# EAGLE design driver-shield-v2 (EAGLE 7.1.0)
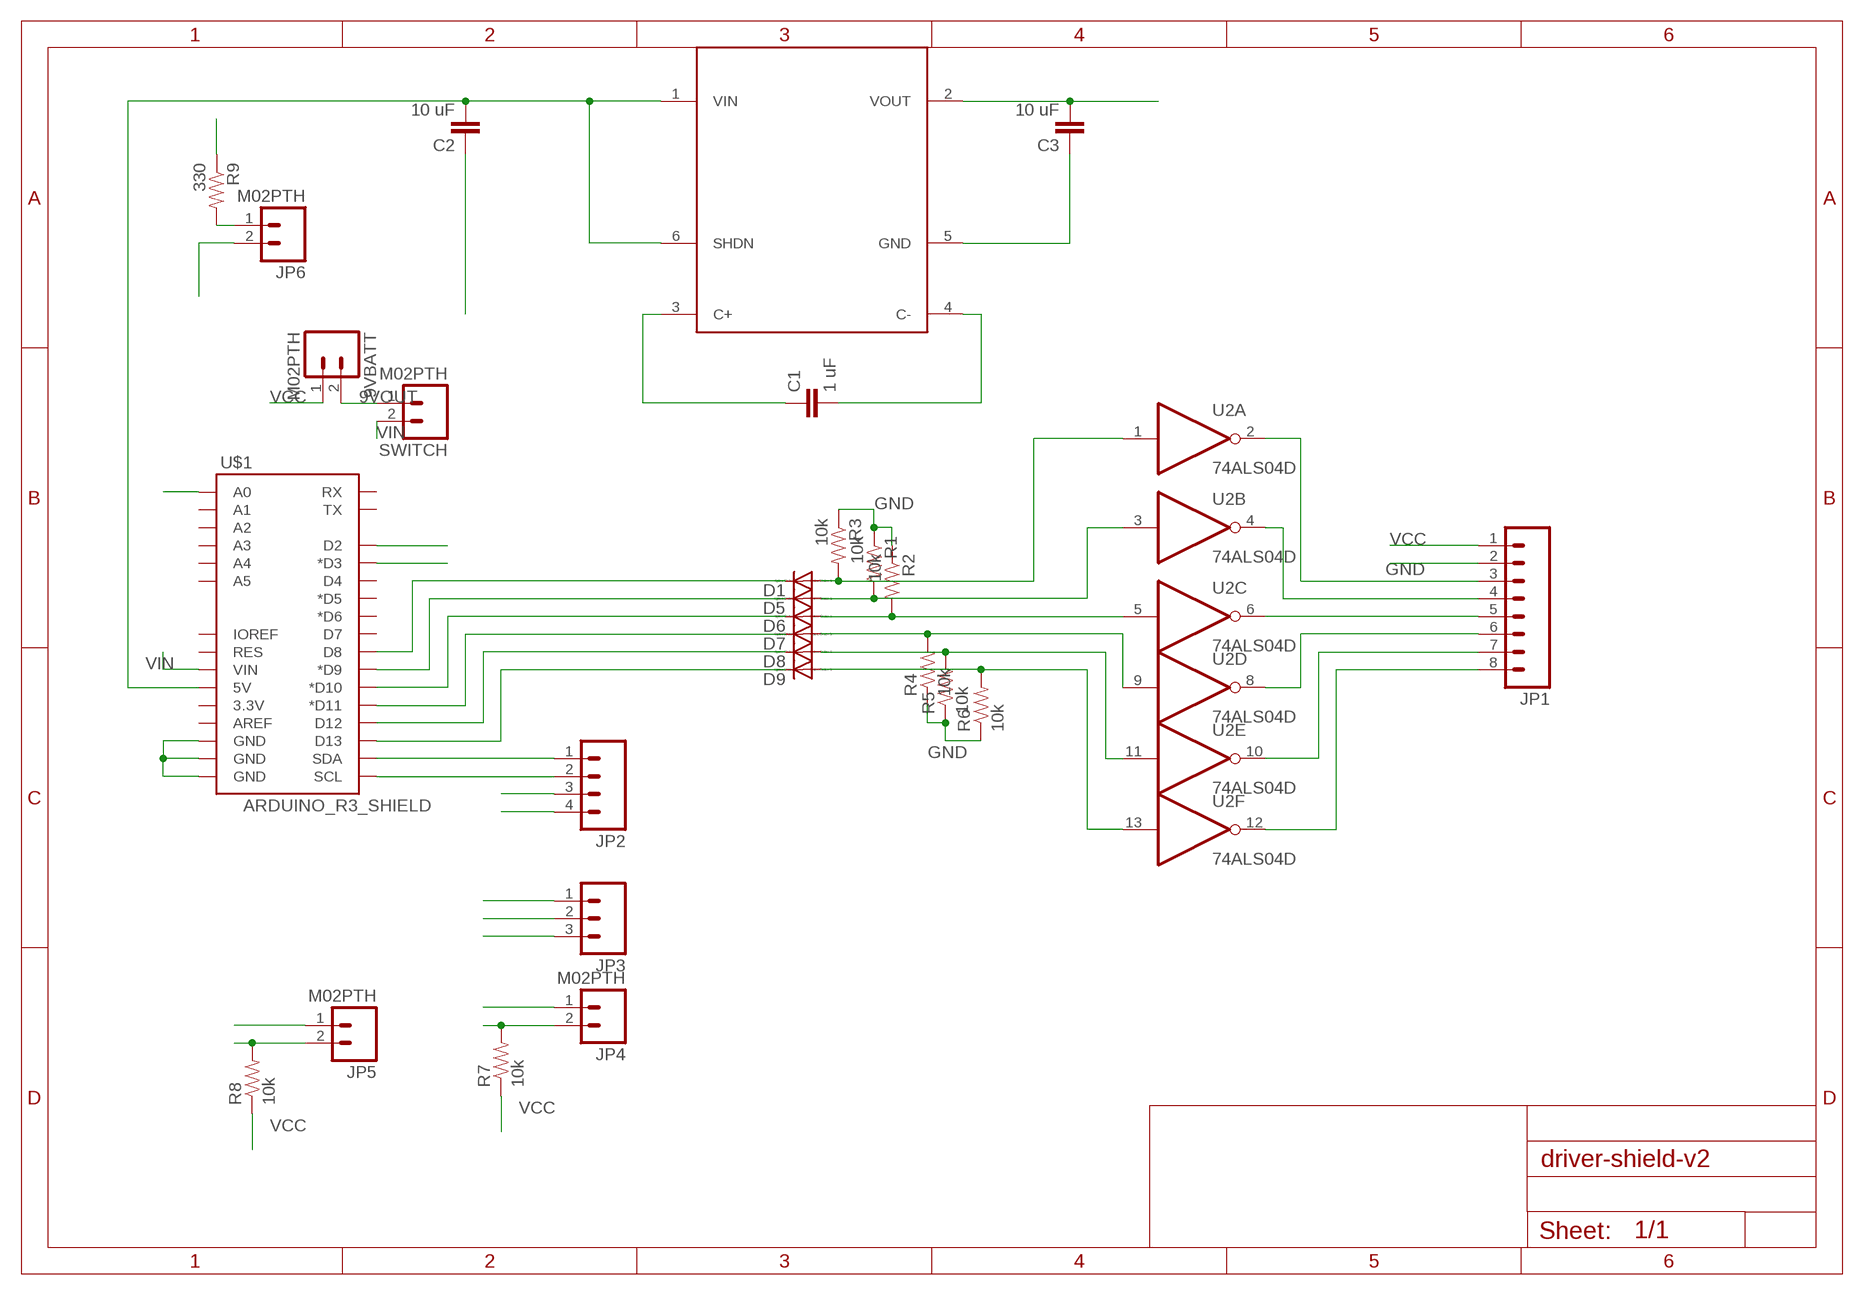
[diagram p0: schematic, sheet 1]

## Parts
9VBATT  M02PTH  [1X02]
C1  1 uF  CAP0805  [0805]
C2  10 uF  CAP0805  [0805]
C3  10 uF  CAP0805  [0805]
D1  DIODE-DO-214AC  [DO-214AC]
D5  DIODE-DO-214AC  [DO-214AC]
D6  DIODE-DO-214AC  [DO-214AC]
D7  DIODE-DO-214AC  [DO-214AC]
D8  DIODE-DO-214AC  [DO-214AC]
D9  DIODE-DO-214AC  [DO-214AC]
JP1  M081X08  [1X08]
JP2  M04PTH  [1X04]
JP3  M03PTH  [1X03]
JP4  M02PTH  [1X02]
JP5  M02PTH  [1X02]
JP6  M02PTH  [1X02]
R1  10k  RESISTOR0603  [0603-RES]
R2  10k  RESISTOR0603  [0603-RES]
R3  10k  RESISTOR0603  [0603-RES]
R4  10k  RESISTOR0603  [0603-RES]
R5  10k  RESISTOR0603  [0603-RES]
R6  10k  RESISTOR0603  [0603-RES]
R7  10k  RESISTOR0603  [0603-RES]
R8  10k  RESISTOR0603  [0603-RES]
R9  330  RESISTOR0603  [0603-RES]
SWITCH  M02PTH  [1X02]
U1  LTC1983  [SSOT23-6]
U2  74ALS04D  [SO14]
U$1  ARDUINO_R3_SHIELD  [UNO_R3_SHIELD]

## Nets
9VOUT: 9VBATT.2 SWITCH.1
+5V: C2.2 JP2.4 JP3.1 JP4.1 R9.1 U1.1(VIN) U1.6(SHDN) U$1.5V
+5V1: JP5.1
A0: JP3.2 U$1.A0
D2: JP4.2 R7.2 U$1.D2
D3: JP5.2 R8.2 U$1.D3(*D3)
GND: C3.2 JP1.2 R1.1 R2.1 R3.1 R4.1 R5.1 R6.1 U1.2(VOUT)
N$2: D5.C U$1.D9(*D9)
N$3: JP2.1 U$1.SDA
N$4: D1.C U$1.D8
N$10: D6.C U$1.D10(*D10)
N$11: D7.C U$1.D11(*D11)
N$13: D8.C U$1.D12
N$14: D9.C U$1.D13
N$15: D1.A R3.2 U2.1(A:I)
N$16: D5.A R1.2 U2.3(B:I)
N$17: JP2.2 U$1.SCL
N$18: D7.A R4.2 U2.9(D:I)
N$19: JP6.1 R9.2
N$20: JP1.6 U2.8(D:O)
N$21: JP1.8 U2.12(F:O)
N$22: JP1.7 U2.10(E:O)
N$24: JP1.5 U2.6(C:O)
N$25: JP1.4 U2.4(B:O)
N$26: JP1.3 U2.2(A:O)
N$28: D6.A R2.2 U2.5(C:I)
N$30: D8.A R5.2 U2.11(E:I)
N$31: D9.A R6.2 U2.13(F:I)
N$33: C1.2 U1.4(C-)
N$34: C1.1 U1.3(C+)
VCC: 9VBATT.1 C2.1 C3.1 JP1.1 JP2.3 JP3.3 JP6.2 R7.1 R8.1 U1.5(GND) U$1.GND@0(GND) U$1.GND@1(GND) U$1.GND@2(GND)
VIN: SWITCH.2 U$1.VIN
Unconnected: U$1.3.3V U$1.A1 U$1.A2 U$1.A3 U$1.A4 U$1.A5 U$1.AREF U$1.D4 U$1.D5(*D5) U$1.D6(*D6) U$1.D7 U$1.IOREF U$1.RES U$1.RX U$1.TX

## Power pins joined to a net without a drawn wire
GND: U2.7(P:GND)
VCC: U2.14(P:VCC)

## Library data of the parts
9VBATT JP4-JP6 SWITCH = SparkFun-Connectors:M02: Standard 2-pin 0.1" header. Use with - straight break away headers ( PRT-00116) - right angle break away headers (PRT-00553) - swiss pins (PRT-00743) - machine pins (PRT-00117) - female headers (PRT-00115) Molex polarized connector foot print use with: PRT-08233 with associated crimp pins and housings. 2.54_SCREWTERM for use with PRT-10571. 3.5mm Screw Terminal footprints for PRT-08084 5mm Screw Terminal footprints for use with PRT-08432
C1-C3 = SparkFun-Capacitors:CAP: Capacitor Standard 0603 ceramic capacitor, and 0.1" leaded capacitor.
D1 D5-D9 = diode:DIODE-: DIODE
JP1 = SparkFun-Connectors:M08: Header 8 Standard 8-pin 0.1" header. Use with straight break away headers (SKU : PRT-00116), right angle break away headers (PRT-00553), swiss pins (PRT-00743), machine pins (PRT-00117), and female headers (PRT-00115).
JP2 = SparkFun-Connectors:M04: Header 4 Standard 4-pin 0.1" header. Use with straight break away headers (SKU : PRT-00116), right angle break away headers (PRT-00553), swiss pins (PRT-00743), machine pins (PRT-00117), and female headers (PRT-00115). Molex polarized connector foot print use with SKU : PRT-08231 with associated crimp pins and housings. 1MM SMD Version SKU: PRT-10208
JP3 = SparkFun-Connectors:M03: Header 3 Standard 3-pin 0.1" header. Use with straight break away headers (SKU : PRT-00116), right angle break away headers (PRT-00553), swiss pins (PRT-00743), machine pins (PRT-00117), and female headers (PRT-00115). Molex polarized connector foot print use with SKU : PRT-08232 with associated crimp pins and housings.
R1-R9 = SparkFun-Resistors:RESISTOR: Resistor Basic schematic elements and footprints for 0603, 1206, and PTH resistors.
U1 = spietz-library:LTC1983
U2 = 74xx-us:74*04: Hex INVERTER
U$1 = SparkFun-Boards:ARDUINO_R3_SHIELD: Shield form compatible with the Arduino Uno R3.

## Net classes
1 vcc: width 0.254 mm

## Board
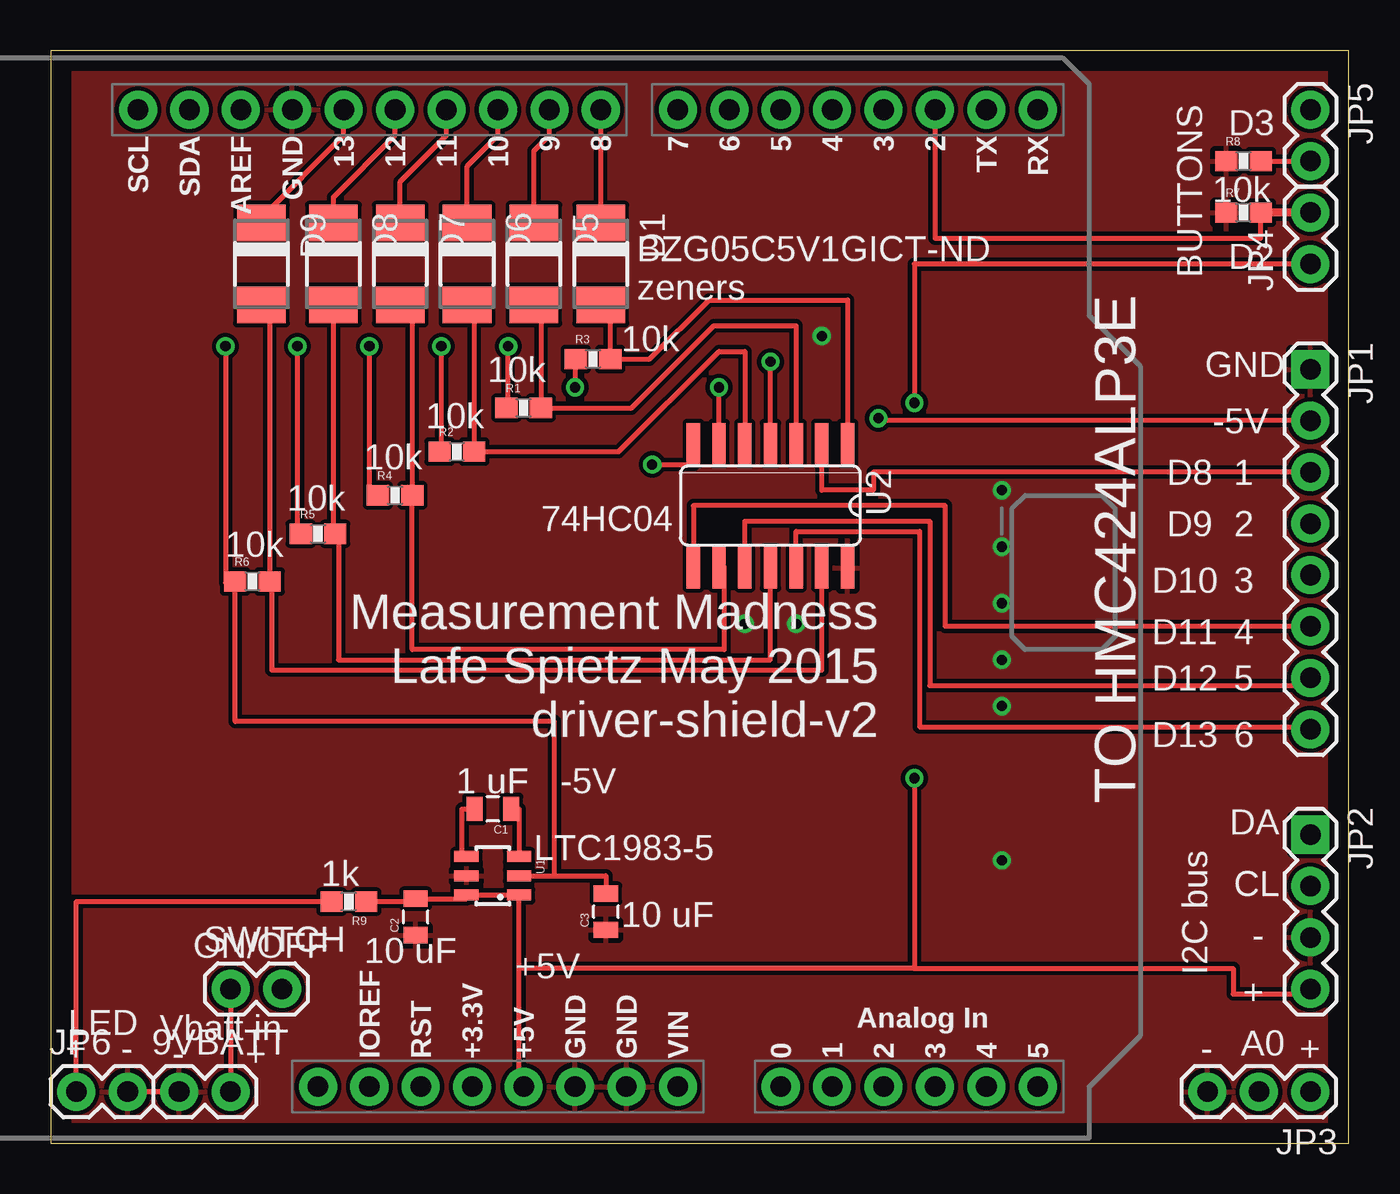
[diagram p1: board, top side]
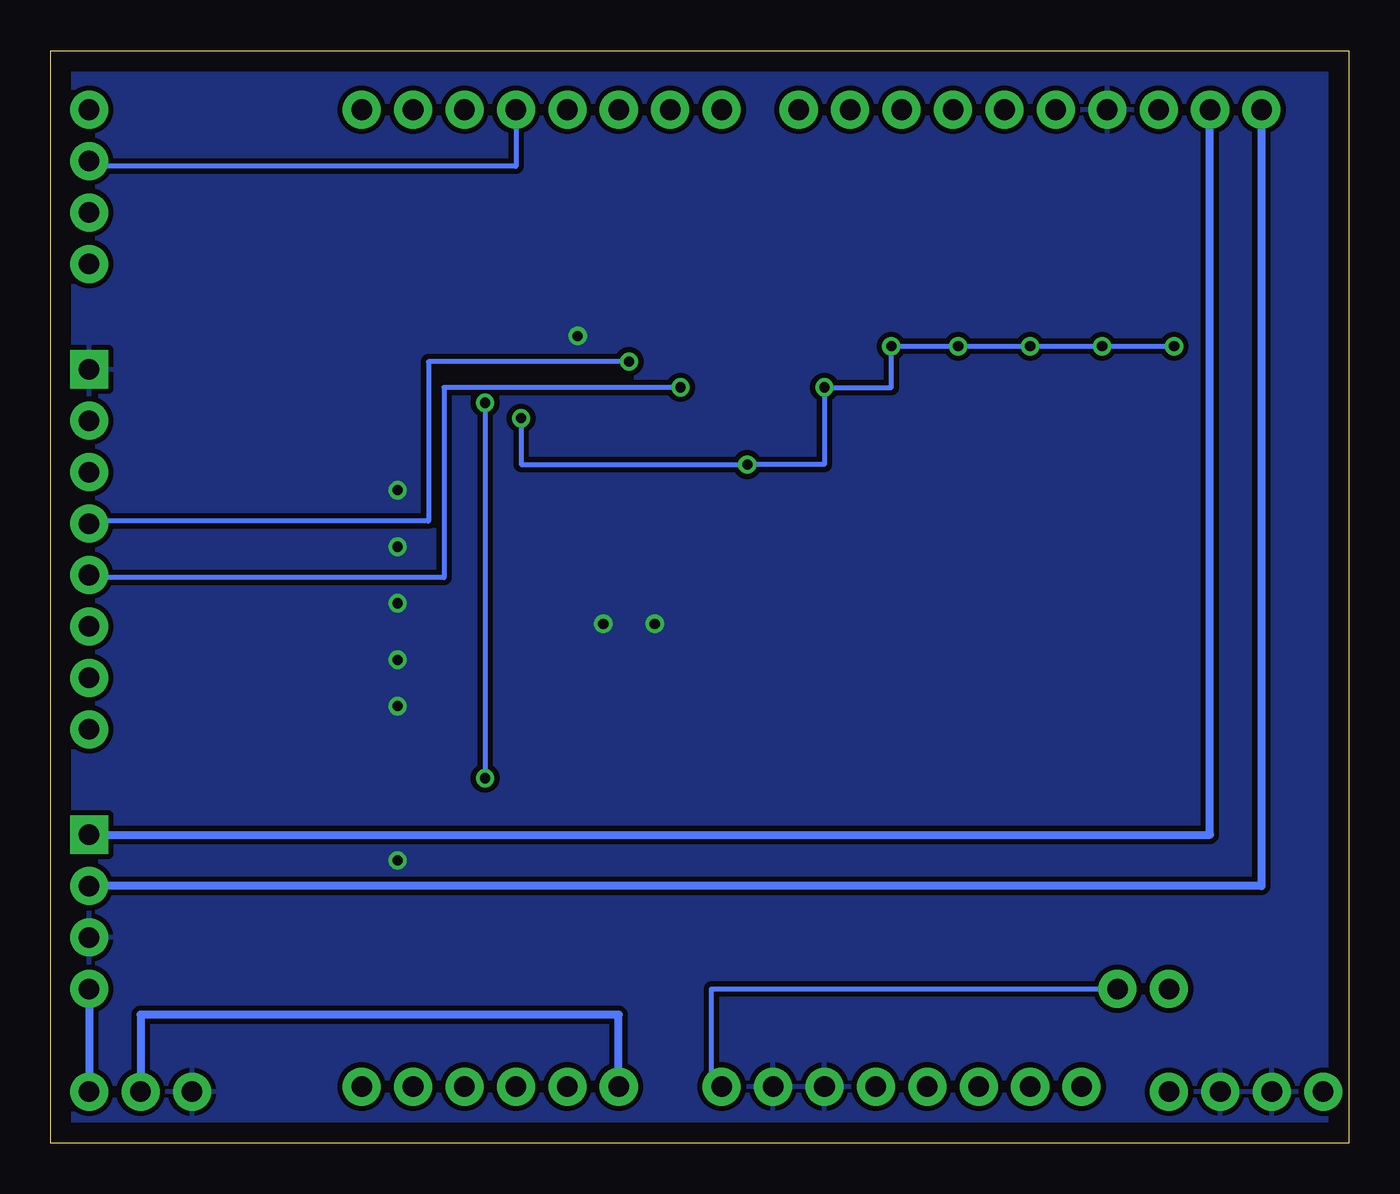
[diagram p2: board, bottom side, seen from below]

Size 64.14 x 53.98 mm. Coordinates in mm from the lower left corner, seen from the top.
Outline: 0,0 64.14,0 64.14,53.98 0,53.98 0,0
Copper layers (1*16): Top 0.035mm / dielectric 1.5mm / Bottom 0.035mm
Design rules "default": minimum track width 10mil, minimum drill 24mil, track to track 8mil, track to pad 8mil, pad to pad 8mil, via to via 8mil, smd to smd 8mil, copper to edge 40mil, drill to drill 8mil, minimum pad ring 10mil, minimum via ring 8mil, stop-mask expansion 4mil, vias tented up to drill 0mil, thermal gap 10mil

### Footprints (pad centres in the part's own frame; a part is rotated, then mirrored left to right if it is on the bottom)
1X02 = drill 1.016 pad 1.88: 1 0,0; 2 2.54,0
0805 = smd 0.8 x 1.2: 1 -0.9,0; 2 0.9,0
DO-214AC = smd 1.8 x 2.4: A 2.025,0; C -2.025,0
1X08 = drill 1.016 pad 1.88 square: 1 0,0 | drill 1.016 pad 1.88: 2 2.54,0; 3 5.08,0; 4 7.62,0; 5 10.16,0; 6 12.7,0; 7 15.24,0; 8 17.78,0
1X04 = drill 1.016 pad 1.88 square: 1 0,0 | drill 1.016 pad 1.88: 2 2.54,0; 3 5.08,0; 4 7.62,0
1X03 = drill 1.016 pad 1.88: 1 0,0; 2 2.54,0; 3 5.08,0
0603-RES = smd 1.1 x 1: 1 -0.85,0; 2 0.85,0
SSOT23-6 = smd 0.55 x 1.2: 1 0.95,1.3; 2 0,1.3; 3 -0.95,1.3; 4 -0.95,-1.3; 5 0,-1.3; 6 0.95,-1.3
SO14 = smd 0.66 x 2.032: 1 -3.81,-3.073; 2 -2.54,-3.073; 3 -1.27,-3.073; 4 0,-3.073; 5 1.27,-3.073; 6 2.54,-3.073; 7 3.81,-3.073; 8 3.81,3.073; 9 2.54,3.073; 10 1.27,3.073; 11 0,3.073; 12 -1.27,3.073; 13 -2.54,3.073; 14 -3.81,3.073
UNO_R3_SHIELD = drill 1.016 pad 1.88: 3.3V 50.8,26.67; 5V 50.8,29.21; A0 50.8,41.91; A1 50.8,44.45; A2 50.8,46.99; A3 50.8,49.53; A4 50.8,52.07; A5 50.8,54.61; AREF 2.54,15.24; D2 2.54,49.53; D3 2.54,46.99; D4 2.54,44.45; D5 2.54,41.91; D6 2.54,39.37; D7 2.54,36.83; D8 2.54,33.02; D9 2.54,30.48; D10 2.54,27.94; D11 2.54,25.4; D12 2.54,22.86; D13 2.54,20.32; GND@0 50.8,31.75; GND@1 50.8,34.29; GND@2 2.54,17.78; IOREF 50.8,21.59; NC 50.8,19.05; RES 50.8,24.13; RX 2.54,54.61; SCL 2.54,10.16; SDA 2.54,12.7; TX 2.54,52.07; VIN 50.8,36.83

### Placement (x,y rotation side)
9VBATT  6.35,2.54 0 top
C1  21.84,16.51 180 top
C2  18.03,11.18 90 top
C3  27.43,11.43 90 top
D1  27.18,43.43 270 top
D5  23.88,43.43 270 top
D6  20.57,43.43 270 top
D7  17.27,43.43 270 top
D8  13.97,43.43 270 top
D9  10.41,43.43 270 top
JP1  62.23,38.23 270 top
JP2  62.23,15.24 270 top
JP3  62.23,2.54 180 top
JP4  62.23,43.43 90 top
JP5  62.23,51.05 270 top
JP6  1.27,2.54 0 top
R1  23.37,36.32 0 top
R2  20.07,34.16 0 top
R3  26.8,38.74 0 top
R4  17.02,32 0 top
R5  13.21,30.1 0 top
R6  9.97,27.75 0 top
R7  58.93,45.97 0 top
R8  58.93,48.51 0 top
R9  14.73,11.94 180 top
SWITCH  8.89,7.62 0 top
U1  21.84,13.21 270 top
U2  35.56,31.5 180 top
U$1  -5.84,53.59 270 top

### Tracks (layer width: path | path; a pad name or v marks a point on that pad's centre or on a via)
9VOUT
  Top 0.254: SWITCH.1 9VBATT.2
+5V  (via drill 0.5)
  Top 0.254: U$1.5V 23.14,2.79 23.14,8.64 | 23.14,8.64 U1.1 U1.6 20.54,12.08 C2.2 18.03,11.94 R9.1 | JP4.1 42.67,43.43 v42.67,36.58 | v42.67,18.03 42.67,8.64 | 42.67,8.64 23.14,8.64 | 42.67,8.64 58.42,8.64 58.42,7.37 62.23,7.37 JP2.4
  Bottom 0.254: v42.67,36.58 v42.67,18.03
  Bottom 0.406: JP2.4 JP3.1
A0
  Bottom 0.406: U$1.A0 36.07,6.35 59.69,6.35 JP3.2
D2
  Top 0.254: U$1.D2 43.69,44.7 59.78,44.7 R7.2
  Top 0.406: JP4.2 R7.2
D3
  Top 0.254: R8.2 JP5.2
  Bottom 0.254: U$1.D3 41.15,48.26 62.23,48.26 JP5.2
GND  (via drill 0.5)
  Top 0.254: JP1.2 40.89,35.69 v40.89,35.81 | v29.72,33.53 31.75,33.53 U2.7 | R3.1 25.91,38.74 v25.91,37.34 | v8.64,39.37 8.64,27.69 9.12,27.69 R6.1 9.12,20.83 24.89,20.83 24.89,13.21 U1.2 27.43,13.21 C3.2 | R5.1 12.19,30.1 v12.19,39.37 | R4.1 15.75,32 v15.75,39.37 | R2.1 19.3,34.16 v19.3,39.37 | R1.1 22.61,36.32 v22.61,39.37
  Bottom 0.254: v40.89,35.81 40.89,33.53 v29.72,33.53 25.91,33.53 v25.91,37.34 22.61,37.34 v22.61,39.37 v19.3,39.37 v15.75,39.37 v12.19,39.37 v8.64,39.37
N$2
  Top 0.254: D5.C 23.88,49.02 24.64,49.78 U$1.D9
N$3
  Bottom 0.406: JP2.1 6.86,15.24 U$1.SDA
N$4
  Top 0.254: U$1.D8 D1.C
N$10
  Top 0.254: D6.C 20.57,48.26 22.1,49.78 U$1.D10
N$11
  Top 0.254: D7.C 17.27,47.5 19.56,49.78 U$1.D11
N$13
  Top 0.254: D8.C 13.97,46.74 17.02,49.78 U$1.D12
N$14
  Top 0.254: D9.C 10.41,45.72 14.48,49.78 U$1.D13
N$15
  Top 0.254: D1.A 27.65,41.41 R3.2 29.59,38.74 32.51,41.66 39.37,41.66 U2.1
N$16
  Top 0.254: D5.A 24.22,41.41 R1.2 28.7,36.32 32.77,40.39 36.83,40.39 U2.3
N$17
  Bottom 0.406: U$1.SCL 4.32,12.7 JP2.2 | JP2.2 62.74,12.7 62.74,12.45 62.23,12.45 JP2.2
N$18
  Top 0.254: D7.A 17.87,41.41 R4.2 17.87,24.38 33.27,24.38 33.27,28.49 U2.9
N$19
  Top 0.254: JP6.1 1.27,11.94 R9.2
N$20
  Top 0.254: JP1.6 44.2,25.53 44.2,31.5 31.75,31.5 U2.8
N$21
  Top 0.254: U2.12 36.83,30.23 42.93,30.23 42.93,20.57 62.23,20.57 JP1.8
N$22
  Top 0.254: U2.10 34.29,30.73 43.43,30.73 43.43,22.61 62.23,22.61 JP1.7
N$24  (via drill 0.5)
  Top 0.254: U2.6 v33.02,37.34
  Bottom 0.254: v33.02,37.34 44.7,37.34 44.7,27.94 62.23,27.94 JP1.5
N$25  (via drill 0.5)
  Top 0.254: U2.4 v35.56,38.61
  Bottom 0.254: v35.56,38.61 45.47,38.61 45.47,30.73 62.23,30.73 JP1.4
N$26
  Top 0.254: JP1.3 40.64,33.15 40.64,32.26 38.1,32.26 U2.2
N$28
  Top 0.254: D6.A 20.92,41.41 R2.2 28.07,34.16 33.02,39.12 34.29,39.12 U2.5
N$30
  Top 0.254: D8.A 13.97,30.1 R5.2 14.22,30.1 14.22,23.88 35.56,23.88 U2.11
N$31
  Top 0.254: D9.A 10.82,41.41 R6.2 10.92,27.75 10.92,23.37 38.1,23.37 U2.13
N$33
  Top 0.254: U1.4 20.32,14.16 20.32,16.51 C1.2
N$34
  Top 0.254: C1.1 23.14,16.51 U1.3
VCC  (via drill 0.5)
  Top 0.254: 9VBATT.1 JP6.2
  other vias: 46.99,21.59 46.99,23.88 46.99,26.67 46.99,29.46 46.99,32.26 46.99,13.97 34.29,25.65 36.83,25.65 38.1,39.88
  pour Top (isolate 0.152): -16.51,57.91 -16.51,-2.54 74.68,-2.54 74.68,58.17
  pour Bottom (isolate 0.254): -17.78,61.09 -17.78,-2.79 74.17,-2.79 75.44,61.09
VIN
  Bottom 0.254: U$1.VIN 31.5,2.79 31.5,7.62 SWITCH.2

### Text on the board
tPlace: BUTTONS | D3 | 10k | D2 | TO HMC424ALP3E | BZG05C5V1GICT-ND / zeners | 10k | GND | 10k | 10k | -5V | D8 | 1 | 10k | 10k | 74HC04 | D9 | 2 | 10k | D10 | 3 | Measurement Madness / Lafe Spietz May 2015 / driver-shield-v2 | D11 | 4 | D12 | 5 | D13 | 6 | 1 uF | -5V | DA | LTC1983-5 | 1k | I2C bus | CL | 10 uF | - | ON/OFF | 10 uF | +5V | + | LED | Vbatt in | + | - | - | + | - | A0 | +